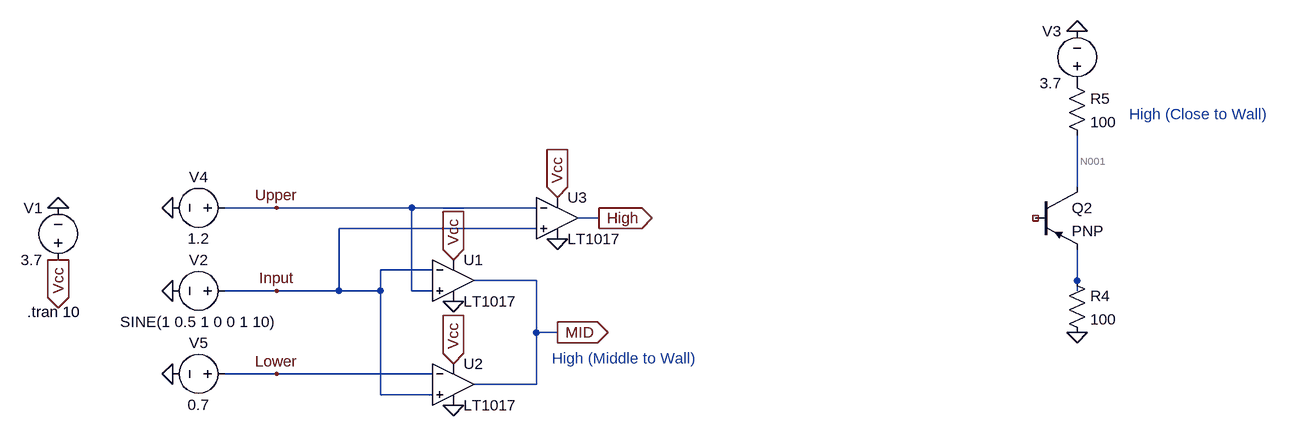
[diagram p0: schematic IR Sensor Design-Draft.asc]
IR Sensor Design-Draft.asc, the LTspice schematic file:
Version 4
SHEET 1 1580 680
WIRE 1264 -16 1264 -96
WIRE 32 16 -48 16
WIRE 240 16 32 16
WIRE 432 16 240 16
WIRE 528 32 496 32
WIRE 432 48 128 48
WIRE 272 112 192 112
WIRE 432 128 336 128
WIRE 1264 128 1264 80
WIRE 32 144 -48 144
WIRE 128 144 128 48
WIRE 128 144 32 144
WIRE 192 144 192 112
WIRE 192 144 128 144
WIRE 240 144 240 16
WIRE 272 144 240 144
WIRE 1264 144 1264 128
WIRE 432 208 432 128
WIRE 464 208 432 208
WIRE 32 272 -48 272
WIRE 272 272 32 272
WIRE 432 288 432 208
WIRE 432 288 336 288
WIRE 192 304 192 144
WIRE 272 304 192 304
FLAG -128 144 0
FLAG -304 16 0
FLAG 1264 -256 0
FLAG -128 16 0
FLAG 1264 208 0
FLAG 304 96 Vcc
IOPIN 304 96 In
FLAG 304 256 Vcc
IOPIN 304 256 In
FLAG -304 96 Vcc
IOPIN -304 96 Out
FLAG 304 160 0
FLAG 304 320 0
FLAG -128 272 0
FLAG 464 0 Vcc
IOPIN 464 0 In
FLAG 464 64 0
FLAG 528 32 High
IOPIN 528 32 Out
FLAG 464 208 MID
IOPIN 464 208 Out
FLAG 32 16 Upper
FLAG 32 272 Lower
FLAG 32 144 Input
SYMBOL voltage -304 112 R180
WINDOW 0 24 96 Left 2
WINDOW 3 24 16 Left 2
WINDOW 123 0 0 Left 0
WINDOW 39 0 0 Left 0
SYMATTR InstName V1
SYMATTR Value 3.7
SYMBOL voltage -32 144 R90
WINDOW 0 -32 56 VBottom 2
WINDOW 3 32 56 VTop 2
WINDOW 123 0 0 Left 0
WINDOW 39 0 0 Left 0
SYMATTR InstName V2
SYMATTR Value SINE(1 0.5 1 0 0 1 10)
SYMBOL voltage 1264 -160 R180
WINDOW 0 24 96 Left 2
WINDOW 3 24 16 Left 2
WINDOW 123 0 0 Left 0
WINDOW 39 0 0 Left 0
SYMATTR InstName V3
SYMATTR Value 3.7
SYMBOL Comparators\\LT1017 304 128 R0
SYMATTR InstName U1
SYMBOL voltage -32 16 R90
WINDOW 0 -32 56 VBottom 2
WINDOW 3 32 56 VTop 2
WINDOW 123 0 0 Left 0
WINDOW 39 0 0 Left 0
SYMATTR InstName V4
SYMATTR Value 1.2
SYMBOL res 1248 -192 R0
SYMATTR InstName R5
SYMATTR Value 100
SYMBOL Comparators\\LT1017 304 288 R0
SYMATTR InstName U2
SYMBOL voltage -32 272 R90
WINDOW 0 -32 56 VBottom 2
WINDOW 3 32 56 VTop 2
WINDOW 123 0 0 Left 0
WINDOW 39 0 0 Left 0
SYMATTR InstName V5
SYMATTR Value 0.7
SYMBOL Comparators\\LT1017 464 32 R0
SYMATTR InstName U3
SYMBOL res 1248 112 R0
SYMATTR InstName R4
SYMATTR Value 100
SYMBOL pnp 1200 -16 R0
SYMATTR InstName Q2
TEXT -352 176 Left 2 !.tran 10
TEXT 1344 -128 Left 2 ;High (Close to Wall)
TEXT 456 248 Left 2 ;High (Middle to Wall)

The netlist it stands for:
* IR Sensor Design-Draft.asc
V1 Vcc 0 3.7
V2 Input 0 SINE(1 0.5 1 0 0 1 10)
V3 P001 0 3.7
XU1 Upper Input Vcc 0 MID LT1017  ; pins In+ In- V+ V- OUT
V4 Upper 0 1.2
R5 P001 N001 100
XU2 Input Lower Vcc 0 MID LT1017  ; pins In+ In- V+ V- OUT
V5 Lower 0 0.7
XU3 Input Upper Vcc 0 High LT1017  ; pins In+ In- V+ V- OUT
R4 N002 0 100
Q2 N001 NC_01 N002 0 PNP
.model NPN NPN
.model PNP PNP
.lib standard.bjt
.tran 10
* High (Close to Wall)
* High (Middle to Wall)
.backanno
.end

* Results of the author's LTspice run, read from the files saved beside the schematic
* Operating Point, zero values left out:
*   V(vcc) = 3.7 V
*   V(input) = 1.009 V
*   V(p001) = 3.7 V
*   V(mid) = 3.66 V
*   V(upper) = 1.2 V
*   V(n001) = 3.7 V
*   V(lower) = 700 mV
*   V(high) = 48.4 mV
*   Ic(Q2) = 6.596 pA
*   Ie(Q2) = -6.596 pA
*   I(R5) = 6.596 pA
*   I(R4) = 6.596 pA
*   I(V1) = -346.6 µA
*   I(V2) = 2.609 nA
*   I(V3) = -6.596 pA
*   I(V4) = -12.18 nA
*   I(V5) = 2.93 nA
*   Ix(u1:1) = 6.09 nA
*   Ix(u1:2) = -2.866 nA
*   Ix(u1:3) = 120.6 µA
*   Ix(u1:4) = -120.6 µA
*   Ix(u1:5) = -3.612 pA
*   Ix(u2:1) = 3.123 nA
*   Ix(u2:2) = -2.93 nA
*   Ix(u2:3) = 120.6 µA
*   Ix(u2:4) = -120.6 µA
*   Ix(u2:5) = -3.612 pA
*   Ix(u3:1) = -2.866 nA
*   Ix(u3:2) = 6.09 nA
*   Ix(u3:3) = 105.4 µA
*   Ix(u3:4) = -105.4 µA
*   Ix(u3:5) = 3.612 pA
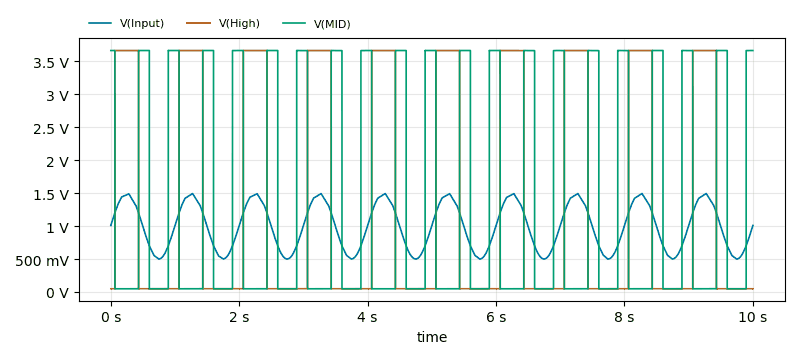
[diagram p1: Transient Analysis of IR Sensor Design-Draft.asc, plotted from the saved traces]
* Transient Analysis, 1 run:
*   V(Input): min 500 mV, max 1.493 V, average 996.1 mV, rms 1.056 V, last 1.009 V
*   V(High): min 48.34 mV, max 3.661 V, average 1.381 V, rms 2.224 V, last 48.4 mV
*   V(MID): min 48.37 mV, max 3.663 V, average 1.262 V, rms 2.122 V, last 3.66 V